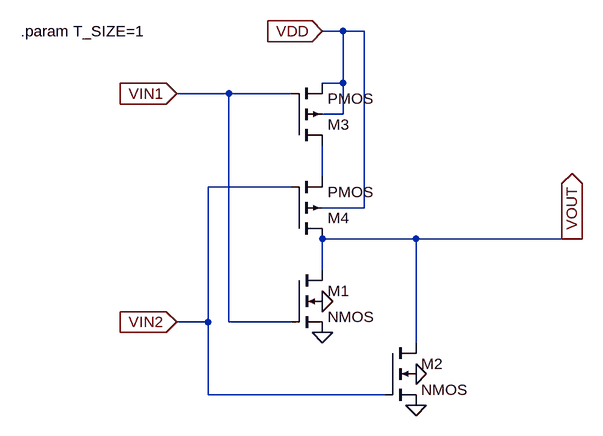
[diagram p0: schematic NOR.asc]
NOR.asc, the LTspice schematic file:
Version 4
SHEET 1 880 680
WIRE 320 -144 288 -144
WIRE 352 -144 320 -144
WIRE 320 -64 320 -144
WIRE 320 -64 288 -64
WIRE 144 -48 64 -48
WIRE 240 -48 144 -48
WIRE 320 -16 320 -64
WIRE 320 -16 288 -16
WIRE 288 80 288 32
WIRE 240 96 112 96
WIRE 352 128 352 -144
WIRE 352 128 288 128
WIRE 432 176 288 176
WIRE 672 176 432 176
WIRE 688 176 672 176
WIRE 288 224 288 176
WIRE 112 304 112 96
WIRE 112 304 64 304
WIRE 144 304 144 -48
WIRE 240 304 144 304
WIRE 432 336 432 176
WIRE 112 416 112 304
WIRE 384 416 112 416
FLAG 64 -48 VIN1
IOPIN 64 -48 In
FLAG 64 304 VIN2
IOPIN 64 304 In
FLAG 288 -144 VDD
IOPIN 288 -144 In
FLAG 672 176 VOUT
IOPIN 672 176 Out
FLAG 432 384 0
FLAG 288 320 0
FLAG 288 272 0
FLAG 432 432 0
SYMBOL nmos4 240 224 R0
SYMATTR InstName M1
SYMATTR Value2 l=90n w='T_SIZE*200n'
SYMBOL nmos4 384 336 R0
SYMATTR InstName M2
SYMATTR Value2 l=90n w='T_SIZE*200n'
SYMBOL pmos4 240 32 M180
SYMATTR InstName M3
SYMATTR Value2 l=90n w='T_SIZE*400n'
SYMBOL pmos4 240 176 M180
SYMATTR InstName M4
SYMATTR Value2 l=90n w='T_SIZE*400n'
TEXT -176 -144 Left 2 !.param T_SIZE=1

The netlist it stands for:
* NOR.asc
M1 VOUT VIN1 0 0 NMOS l=90n w='T_SIZE*200n'
M2 VOUT VIN2 0 0 NMOS l=90n w='T_SIZE*200n'
M3 N001 VIN1 VDD VDD PMOS l=90n w='T_SIZE*400n'
M4 VOUT VIN2 N001 VDD PMOS l=90n w='T_SIZE*400n'
.model NMOS NMOS
.model PMOS PMOS
.lib standard.mos
.param T_SIZE=1
.backanno
.end